# EAGLE schematic beaglebone-cape (EAGLE 7.5.0)
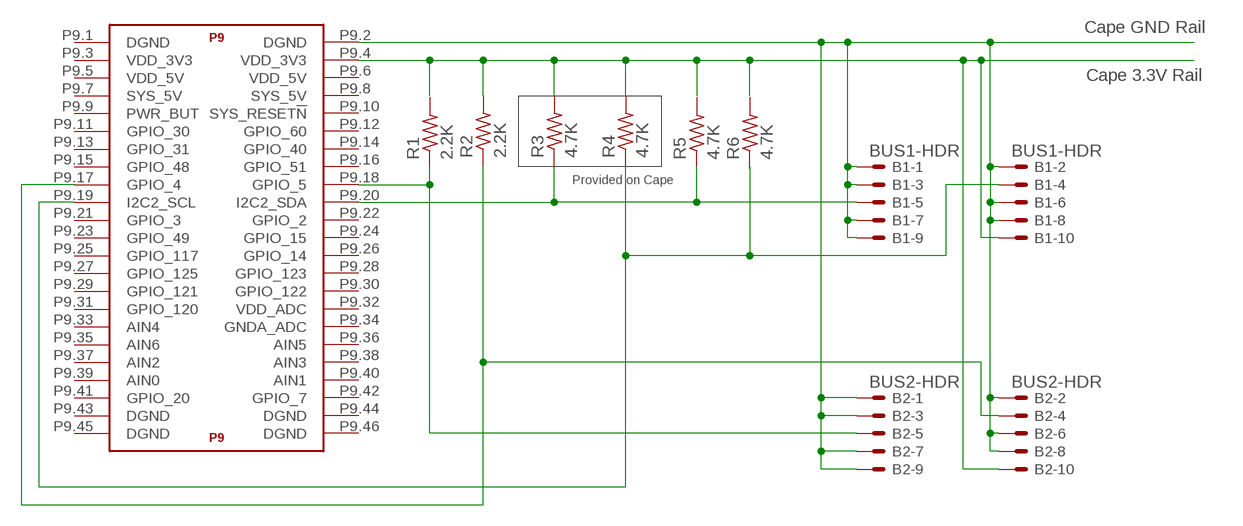
[diagram p0: schematic, sheet 1]

## Parts
B1  BUS1-HDR  87758-1016  [87758-1016]
B2  BUS2-HDR  87758-1016  [87758-1016]
R1  2.2K  R-US_0207/15  [0207/15]
R2  2.2K  R-US_0207/15  [0207/15]
R3  4.7K  R-US_0207/15  [0207/15]
R4  4.7K  R-US_0207/15  [0207/15]
R5  4.7K  R-US_0207/15  [0207/15]
R6  4.7K  R-US_0207/15  [0207/15]
U$6  BEAGLE_BONE_BLACK_CAPE  [BEAGLE_BONE_BLACK_CAPE]

## Nets
GND: B1.1 B1.2 B1.3 B1.6 B1.7 B1.8 B1.9 B2.1 B2.2 B2.3 B2.6 B2.7 B2.8 B2.9 U$6.P9.2(P9:DGND)
I2C1_SCL: B2.4 R2.1 U$6.P9.17(P9:GPIO_4)
I2C1_SDA: B2.5 U$6.P9.18(P9:GPIO_5)
I2C2_SCL: B1.4 R4.1 U$6.P9.19(P9:I2C2_SCL)
I2C2_SDA: B1.5 R3.1 U$6.P9.20(P9:I2C2_SDA)
VDD: B1.10 B2.10 R2.2 R3.2 R4.2 U$6.P9.4(P9:VDD_3V3)
Unconnected: R1.1 R1.2 R5.1 R5.2 R6.1 R6.2 U$6.P8.1(P8:DGND) U$6.P8.2(P8:DGND) U$6.P8.3(P8:GPIO_38) U$6.P8.4(P8:GPIO_39) U$6.P8.5(P8:GPIO_34) U$6.P8.6(P8:GPIO_35) U$6.P8.7(P8:GPIO_66) U$6.P8.8(P8:GPIO_67) U$6.P8.9(P8:GPIO_69) U$6.P8.10(P8:GPIO_68) U$6.P8.11(P8:GPIO_45) U$6.P8.12(P8:GPIO_44) U$6.P8.13(P8:GPIO_23) U$6.P8.14(P8:GPIO_26) U$6.P8.15(P8:GPIO_47) U$6.P8.16(P8:GPIO_46) U$6.P8.17(P8:GPIO_27) U$6.P8.18(P8:GPIO_65) U$6.P8.19(P8:GPIO_22) U$6.P8.20(P8:GPIO_63) U$6.P8.21(P8:GPIO_62) U$6.P8.22(P8:GPIO_37) U$6.P8.23(P8:GPIO_36) U$6.P8.24(P8:GPIO_33) U$6.P8.25(P8:GPIO_32) U$6.P8.26(P8:GPIO_61) U$6.P8.27(P8:GPIO_86) U$6.P8.28(P8:GPIO_88) U$6.P8.29(P8:GPIO_87) U$6.P8.30(P8:GPIO_89) U$6.P8.31(P8:GPIO_10) U$6.P8.32(P8:GPIO_11) U$6.P8.33(P8:GPIO_9) U$6.P8.34(P8:GPIO_81) U$6.P8.35(P8:GPIO_8) U$6.P8.36(P8:GPIO_80) U$6.P8.37(P8:GPIO_78) U$6.P8.38(P8:GPIO_79) U$6.P8.39(P8:GPIO_76) U$6.P8.40(P8:GPIO_77) U$6.P8.41(P8:GPIO_74) U$6.P8.42(P8:GPIO_75) U$6.P8.43(P8:GPIO_72) U$6.P8.44(P8:GPIO_73) U$6.P8.45(P8:GPIO_70) U$6.P8.46(P8:GPIO_71) U$6.P9.1(P9:DGND) U$6.P9.3(P9:VDD_3V3) U$6.P9.5(P9:VDD_5V) U$6.P9.6(P9:VDD_5V) U$6.P9.7(P9:SYS_5V) U$6.P9.8(P9:SYS_5V) U$6.P9.9(P9:PWR_BUT) U$6.P9.10(P9:SYS_RESET!N) U$6.P9.11(P9:GPIO_30) U$6.P9.12(P9:GPIO_60) U$6.P9.13(P9:GPIO_31) U$6.P9.14(P9:GPIO_40) U$6.P9.15(P9:GPIO_48) U$6.P9.16(P9:GPIO_51) U$6.P9.21(P9:GPIO_3) U$6.P9.22(P9:GPIO_2) U$6.P9.23(P9:GPIO_49) U$6.P9.24(P9:GPIO_15) U$6.P9.25(P9:GPIO_117) U$6.P9.26(P9:GPIO_14) U$6.P9.27(P9:GPIO_125) U$6.P9.28(P9:GPIO_123) U$6.P9.29(P9:GPIO_121) U$6.P9.30(P9:GPIO_122) U$6.P9.31(P9:GPIO_120) U$6.P9.32(P9:VDD_ADC) U$6.P9.33(P9:AIN4) U$6.P9.34(P9:GNDA_ADC) U$6.P9.35(P9:AIN6) U$6.P9.36(P9:AIN5) U$6.P9.37(P9:AIN2) U$6.P9.38(P9:AIN3) U$6.P9.39(P9:AIN0) U$6.P9.40(P9:AIN1) U$6.P9.41(P9:GPIO_20) U$6.P9.42(P9:GPIO_7) U$6.P9.43(P9:DGND) U$6.P9.44(P9:DGND) U$6.P9.45(P9:DGND) U$6.P9.46(P9:DGND)

## Notes on the sheet
- Cape GND Rail
- Cape 3.3V Rail
- Provided on Cape

## Library data of the parts
B1 = con-molex:87758-1016: 10 Pin - 2mm Dual Row Single Wafer, Vertical T/H HDR Source: http://www.molex.com/pdm_docs/sd/877580616_sd.pdf; MF: MOLEX; MPN: BUS1-HDR; OC_FARNELL: 7472340; OC_NEWARK: 59J1558
B2 = con-molex:87758-1016: 10 Pin - 2mm Dual Row Single Wafer, Vertical T/H HDR Source: http://www.molex.com/pdm_docs/sd/877580616_sd.pdf; MF: MOLEX; MPN: BUS2-HDR; OC_FARNELL: 7472340; OC_NEWARK: 59J1558
R1-R6 = rcl:R-US_: RESISTOR, American symbol
U$6 = SparkFun-Boards:BEAGLE_BONE_BLACK_CAPE